# EAGLE design untitled (EAGLE 9.6.1)
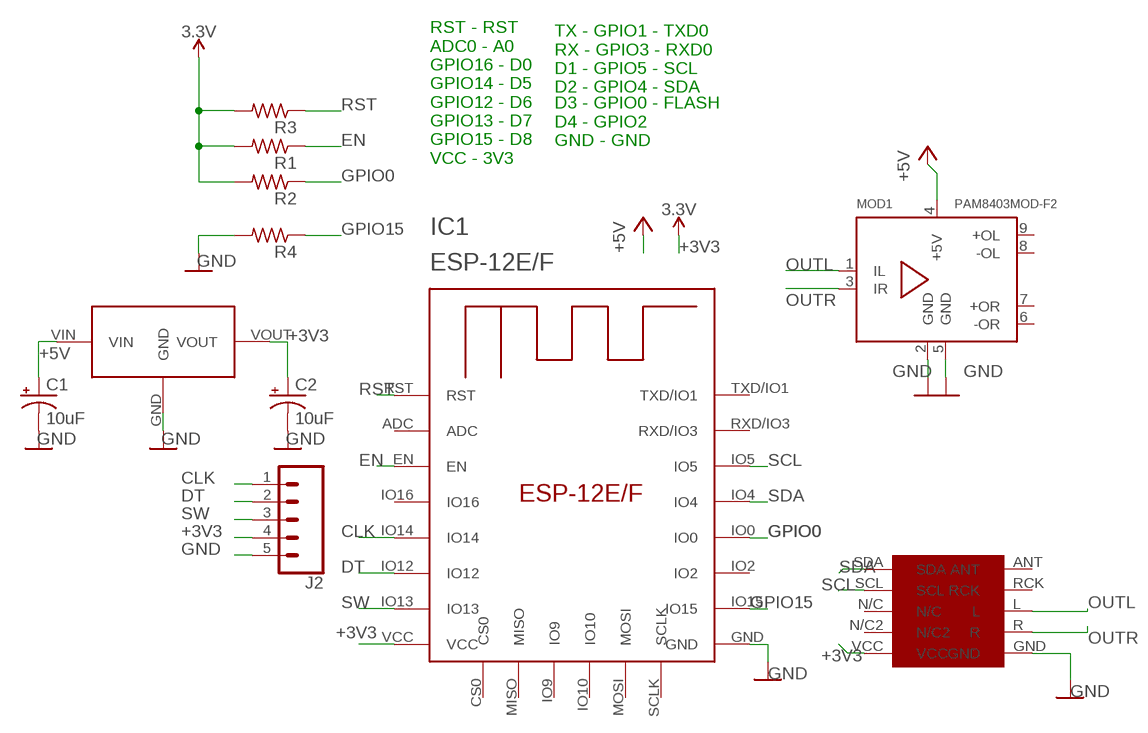
[diagram p0: schematic, sheet 1]

## Parts
C1  10uF  10UF-TANT  [EIA3216]
C2  10uF  10UF-TANT  [EIA3216]
IC1  ESP-12E/F  [ESP-12E]
J2  CONN_05PTH_LONGPADS  [1X05_LONGPADS]
MOD1  PAM8403MOD-F2  [PAM8403MOD2]
R1  R-US_R0805  [R0805]
R2  R-US_R0805  [R0805]
R3  R-US_R0805  [R0805]
R4  R-US_R0805  [R0805]
U$1  RDA  [RDA]
U$2  HT7333  [SOT89]

## Nets
3.3V: R1.2 R2.2 R3.2
+3V3: C2.A(+) IC1.VCC J2.4 U$1.VCC U$2.VOUT ; supply symbol labelled 3.3V
+5V: C1.A(+) MOD1.4(+5V) U$2.VIN
CLK: IC1.IO14 J2.1
DT: IC1.IO12 J2.2
EN: IC1.EN R1.1
GND: C1.C(-) C2.C(-) IC1.GND J2.5 MOD1.2(GND) MOD1.5(GND) R4.2 U$1.GND U$2.GND ; supply symbol labelled AGND
GPIO0: IC1.IO0 R2.1
GPIO15: IC1.IO15 R4.1
OUTL: MOD1.1(IL) U$1.L
OUTR: MOD1.3(IR) U$1.R
RST: IC1.RST R3.1
SCL: IC1.IO5 U$1.SCL
SDA: IC1.IO4 U$1.SDA
SW: IC1.IO13 J2.3
Unconnected: IC1.ADC IC1.CS0 IC1.IO2 IC1.IO9 IC1.IO10 IC1.IO16 IC1.MISO IC1.MOSI IC1.RXD/IO3 IC1.SCLK IC1.TXD/IO1 MOD1.6(-OR) MOD1.7(+OR) MOD1.8(-OL) MOD1.9(+OL) U$1.ANT U$1.N/C U$1.N/C2 U$1.RCK

## Notes on the sheet
- TX - GPIO1 - TXD0
  RX - GPIO3 - RXD0
  D1 - GPIO5 - SCL
  D2 - GPIO4 - SDA
- D3 - GPIO0 - FLASH
  D4 - GPIO2
  GND - GND
- RST - RST 
  ADC0 - A0
  GPIO16 - D0
  GPIO14 - D5
  GPIO12 - D6
  GPIO13 - D7
  GPIO15 - D8
  VCC - 3V3

## Library data of the parts
C1 C2 = SparkFun-Retired:10UF-TANT: 10uF Tantalum SMT CAP-00811- 16V 10% (EIA-3216); PROD_ID: CAP-00811
IC1 = esp-12e-f:ESP-12E/F
J2 = SparkFun-Connectors:CONN_05: Multi connection point. Often used as Generic Header-pin footprint for 0.1 inch spaced/style header connections On any of the 0.1 inch spaced packages, you can populate with these: Break Away Headers - Straight <https://www.sparkfun.com/products/116> (PRT-00116) Break Away Male Headers - Right Angle <https://www.sparkfun.com/products/553> (PRT-00553) Female Headers <https://www.sparkfun.com/products/115> (PRT-00115) Break Away Headers - Machine Pin <https://www.sparkfun.com/products/117> (PRT-00117) Break Away Female Headers - Swiss Machine Pin <https://www.sparkfun.com/products/743> (PRT-00743) For SCREWTERMINALS and SPRING TERMINALS visit here: Screw Terimnals on SparkFun.com <https://www.sparkfun.com/search/results?term=Screw+Terminals> (5mm/3.5mm/2.54mm spacing) This device is also useful as a general connection point to wire up your design to another part of your project. Our various solder wires solder well into these plated through hole pads. Hook-Up Wire - Assortment (Stranded, 22 AWG) <https://www.sparkfun.com/products/11375> (PRT-11375) Hook-Up Wire - Assortment (Solid Core, 22 AWG) <https://www.sparkfun.com/products/11367> (PRT-11367) View the entire wire category on our website here <https://www.sparkfun.com/categories/141> Special notes: Molex polarized connector foot print use with SKU : PRT-08231 with associated crimp pins and housings. 1MM SMD Version SKU: PRT-10208
MOD1 = dl9sec_public:PAM8403MOD: PAM8403 module 2x3W@4R
R1-R4 = adafruit:R-US_: RESISTOR, American symbol
U$1 = RDA:RDA
U$2 = HT7333_SOT89:HT7333

## Board
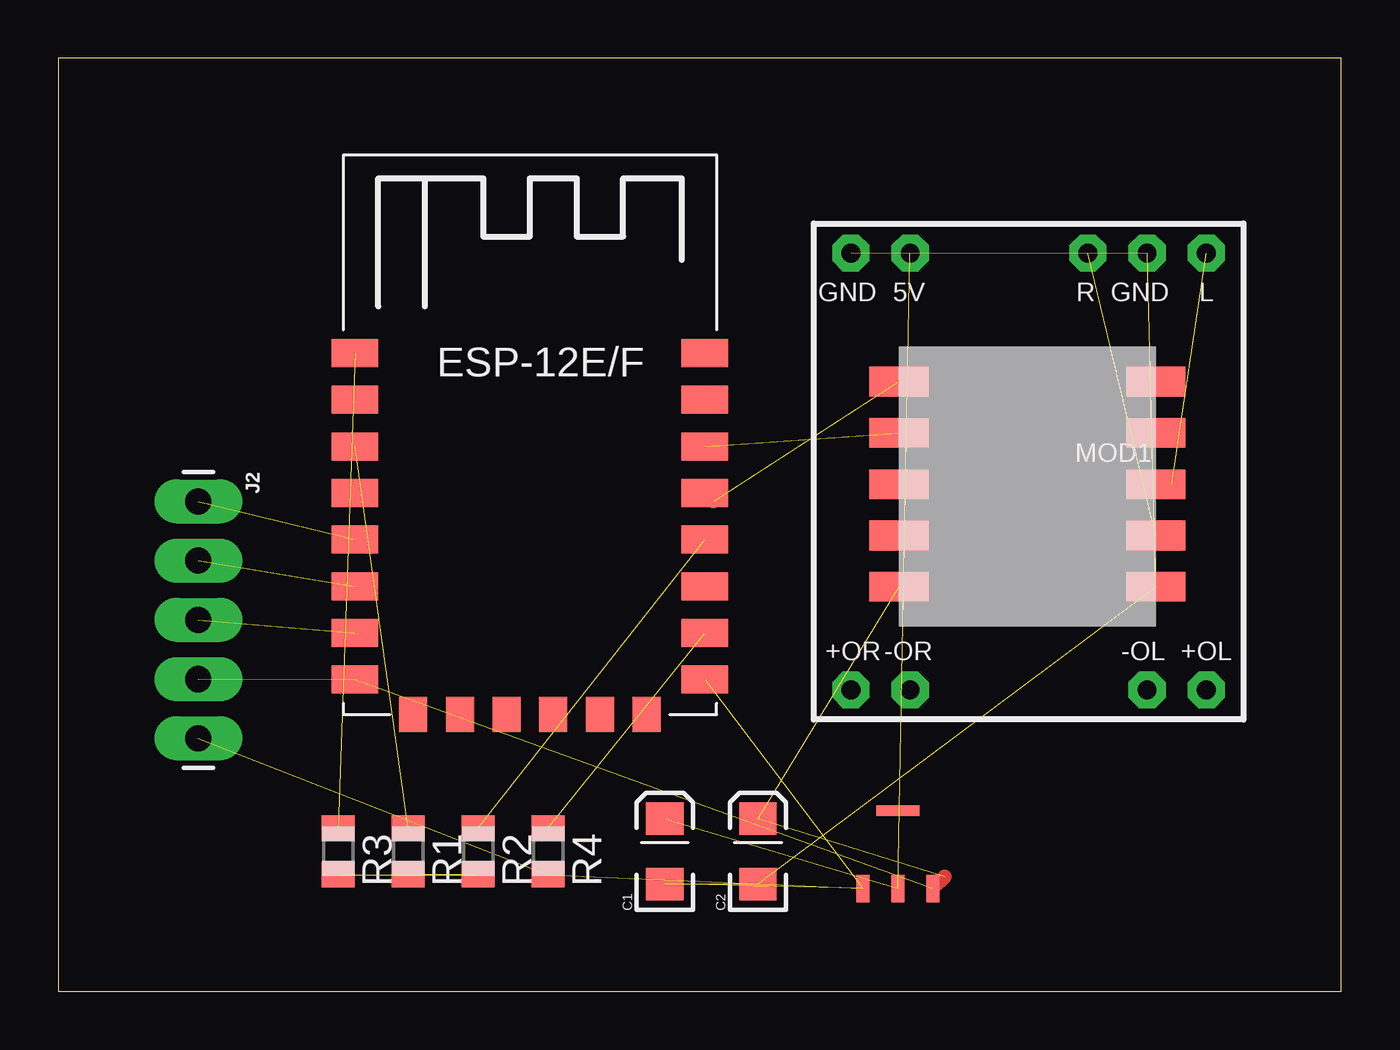
[diagram p1: board, top side]

Size 55 x 40 mm. Coordinates in mm from the lower left corner, seen from the top.
Outline: 0,0 55,0 55,40 0,40 0,0
Copper layers (1*16): Top 0.035mm / dielectric 1.5mm / Bottom 0.035mm
Design rules "default": minimum track width 6mil, minimum drill 0.35mm, track to track 6mil, track to pad 6mil, pad to pad 6mil, via to via 6mil, smd to smd 6mil, copper to edge 40mil, drill to drill 6mil, minimum pad ring 10mil, minimum via ring 8mil, stop-mask expansion 4mil, vias tented up to drill 0mil, thermal gap 10mil

### Footprints (pad centres in the part's own frame; a part is rotated, then mirrored left to right if it is on the bottom)
EIA3216 = smd 1.4 x 1.6: A 1.4,0; C -1.4,0
ESP-12E = smd 2 x 1.2: ADC -7.46,5.53; EN -7.46,3.53; GND 7.54,-6.47; IO0 7.54,-0.47; IO2 7.54,-2.47; IO4 7.54,1.53; IO5 7.54,3.53; IO12 -7.46,-2.47; IO13 -7.46,-4.47; IO14 -7.46,-0.47; IO15 7.54,-4.47; IO16 -7.46,1.53; RST -7.46,7.53; RXD/IO3 7.54,5.53; TXD/IO1 7.54,7.53; VCC -7.46,-6.47 | smd 1.2 x 1.5: CS0 -4.96,-7.97; IO9 -0.96,-7.97; IO10 1.04,-7.97; MISO -2.96,-7.97; MOSI 3.04,-7.97; SCLK 5.04,-7.97
1X05_LONGPADS = drill 1.118 pad 1.88 long: 1 0,0; 2 2.54,0; 3 5.08,0; 4 7.62,0; 5 10.16,0
PAM8403MOD2 = drill 0.8 pad 1.6 octagon: 1 0,0; 2 2.54,0; 3 5.08,0; 4 12.7,0; 5 15.24,0; 6 15.24,18.733; 7 12.7,18.733; 8 2.54,18.733; 9 0,18.733
R0805 = smd 1.1 x 1.4: 1 -1,0; 2 1,0
RDA = smd 2.54 x 1.27: ANT 11,-1.5; GND 11,-10.3; L 11,-5.9; N/C 0,-5.9; N/C2 0,-8.1; R 11,-8.1; RCK 11,-3.7; SCL 0,-3.7; SDA 0,-1.5; VCC 0,-10.3
SOT89 = smd 0.559 x 1.194: GND -1.499,-0.597; VIN 0,-0.597; VOUT 1.499,-0.597 | smd 1.829 x 0.457: P$4 0,2.743

### Placement (x,y rotation side)
C1  26,6 90 top
C2  30,6 90 top
IC1  20.18,19.83 0 top
J2  6,21 270 top
MOD1  49.22,31.65 180 top
R1  15,6 270 top
R2  18,6 270 top
R3  12,6 270 top
R4  21,6 270 top
U$1  36.05,27.64 0 top
U$2  36,5 0 top

### Tracks (layer width: path | path; a pad name or v marks a point on that pad's centre or on a via)
3.3V  (2 unrouted)
+3V3  (4 unrouted)
  Top 0.61: 38,4.9 U$2.VOUT
+5V  (2 unrouted)
CLK  (1 unrouted)
DT  (1 unrouted)
EN  (1 unrouted)
GND  (8 unrouted)
  Top 0.61: MOD1.5 34,31.67
GPIO0  (1 unrouted)
GPIO15  (1 unrouted)
OUTL  (1 unrouted)
  Top 0.61: 47.74,21.74 U$1.L
OUTR  (1 unrouted)
RST  (1 unrouted)
SCL  (1 unrouted)
  Top 0.61: U$1.SCL 36.11,24 | 27.68,23.32 IC1.IO5
SDA  (1 unrouted)
  Top 0.61: 28.08,21 IC1.IO4
SW  (1 unrouted)